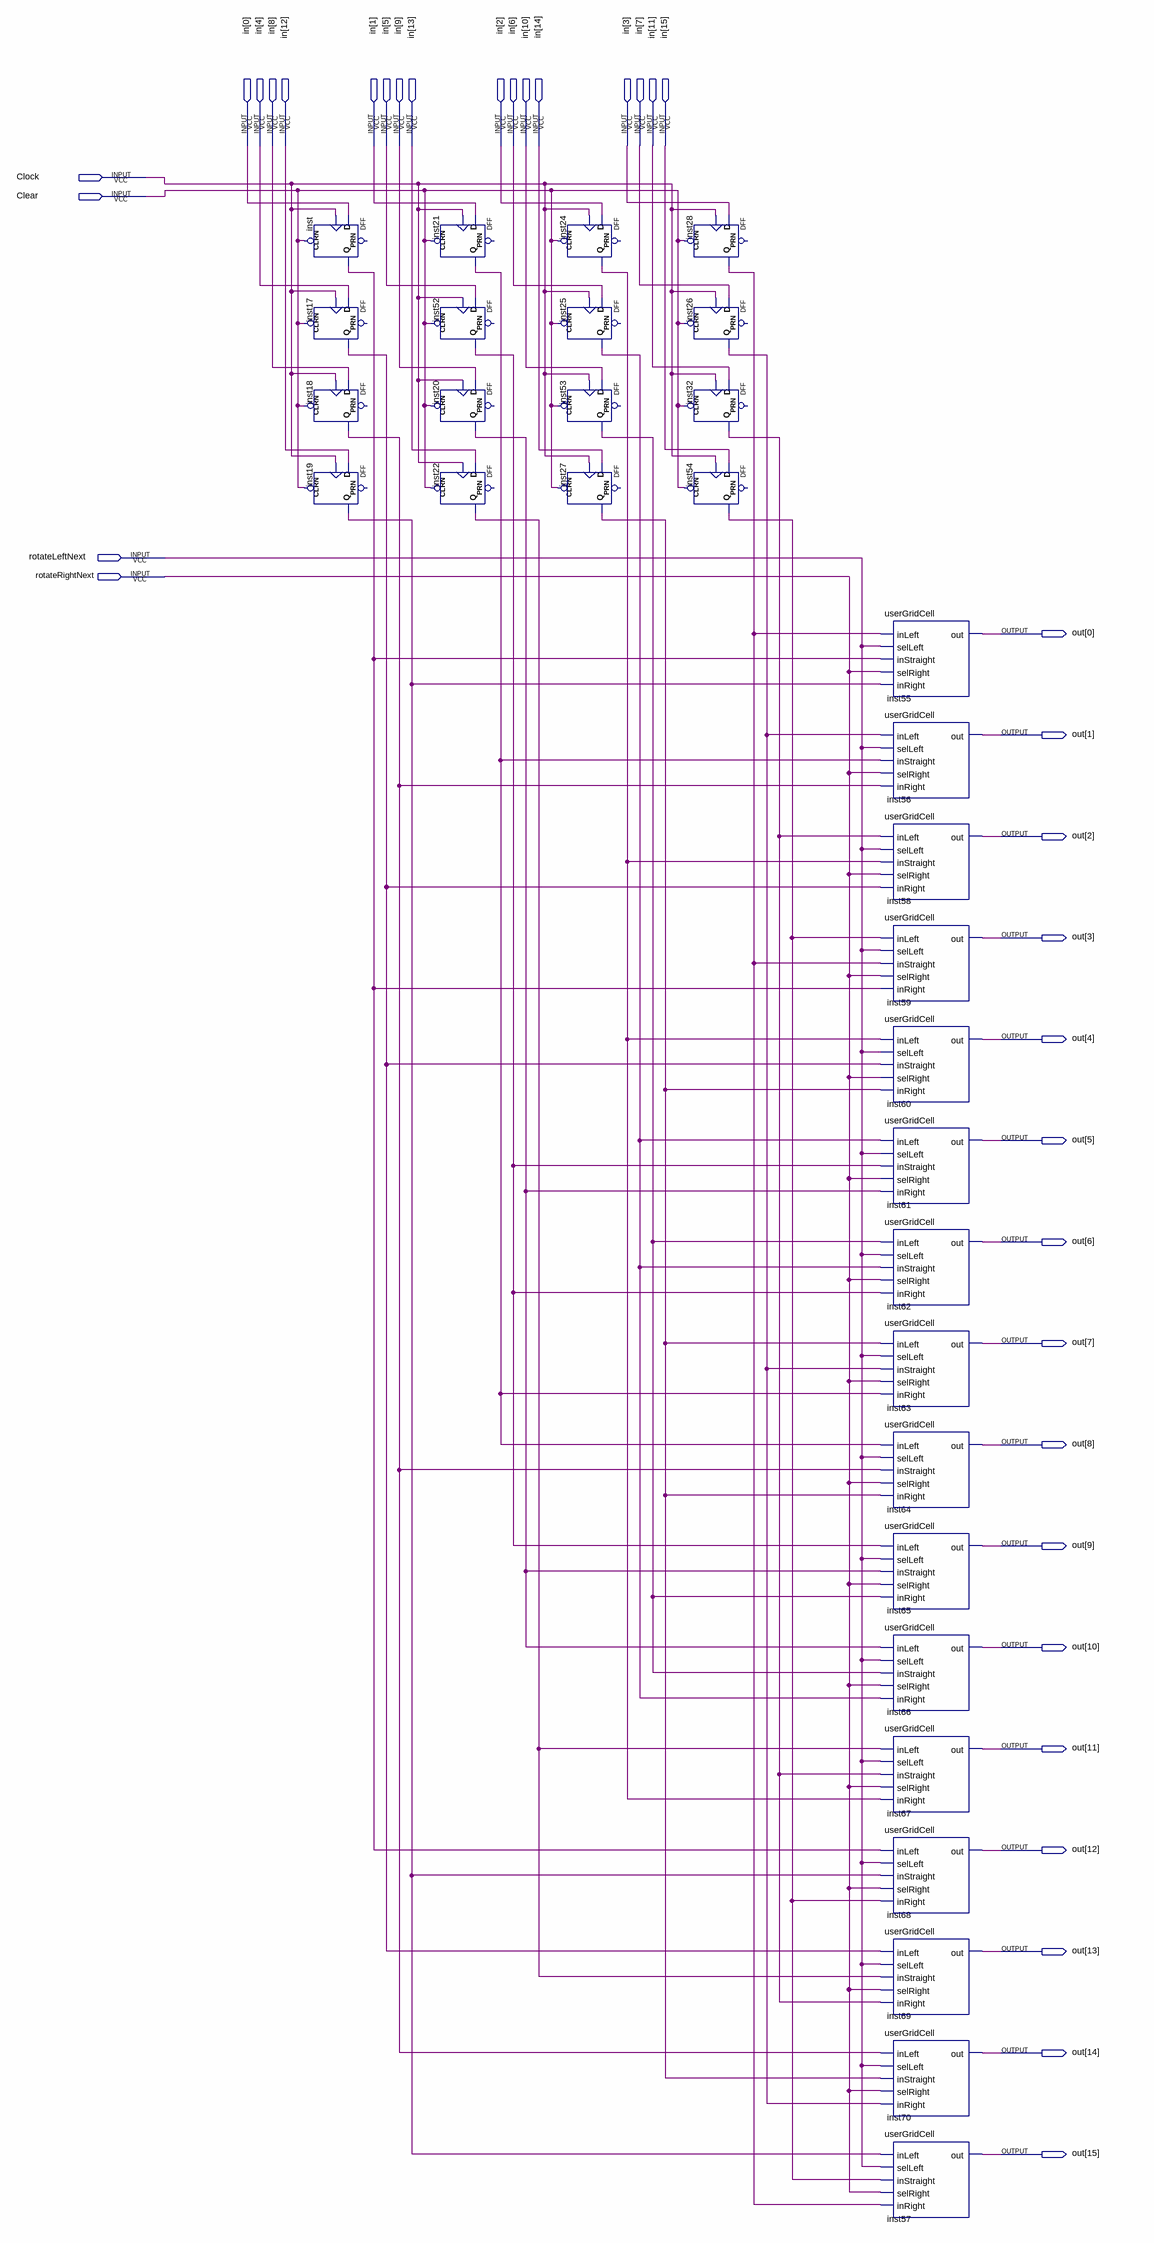
[diagram p0: schematic sheet]
// Quartus schematic userGrid.bdf as structural Verilog: 32 symbols, 36 pins
module userGrid (
  input  [15:0] in,
  input  Clock,
  input  Clear,
  input  rotateLeftNext,
  input  rotateRightNext,
  output [15:0] out
);

  wire inst17_q, inst18_q, inst19_q, inst20_q, inst21_q, inst22_q, inst24_q, inst25_q, inst26_q, inst27_q,
       inst28_q, inst32_q, inst52_q, inst53_q, inst54_q, inst_q;

  DFF inst (.CLRN(Clear), .CLK(Clock), .D(in[0]), .Q(inst_q));  // open: PRN
  DFF inst17 (.CLRN(Clear), .CLK(Clock), .D(in[4]), .Q(inst17_q));  // open: PRN
  DFF inst18 (.CLRN(Clear), .CLK(Clock), .D(in[8]), .Q(inst18_q));  // open: PRN
  DFF inst19 (.CLRN(Clear), .CLK(Clock), .D(in[12]), .Q(inst19_q));  // open: PRN
  DFF inst21 (.CLRN(Clear), .CLK(Clock), .D(in[1]), .Q(inst21_q));  // open: PRN
  DFF inst52 (.CLRN(Clear), .CLK(Clock), .D(in[5]), .Q(inst52_q));  // open: PRN
  DFF inst20 (.CLRN(Clear), .CLK(Clock), .D(in[9]), .Q(inst20_q));  // open: PRN
  DFF inst22 (.CLRN(Clear), .CLK(Clock), .D(in[13]), .Q(inst22_q));  // open: PRN
  DFF inst24 (.CLRN(Clear), .CLK(Clock), .D(in[2]), .Q(inst24_q));  // open: PRN
  DFF inst25 (.CLRN(Clear), .CLK(Clock), .D(in[6]), .Q(inst25_q));  // open: PRN
  DFF inst53 (.CLRN(Clear), .CLK(Clock), .D(in[10]), .Q(inst53_q));  // open: PRN
  DFF inst27 (.CLRN(Clear), .CLK(Clock), .D(in[14]), .Q(inst27_q));  // open: PRN
  DFF inst28 (.CLRN(Clear), .CLK(Clock), .D(in[3]), .Q(inst28_q));  // open: PRN
  DFF inst26 (.CLRN(Clear), .CLK(Clock), .D(in[7]), .Q(inst26_q));  // open: PRN
  DFF inst32 (.CLRN(Clear), .CLK(Clock), .D(in[11]), .Q(inst32_q));  // open: PRN
  DFF inst54 (.CLRN(Clear), .CLK(Clock), .D(in[15]), .Q(inst54_q));  // open: PRN
  userGridCell inst55 (
    .inLeft(inst28_q), .selLeft(rotateLeftNext), .inStraight(inst_q), .selRight(rotateRightNext),
    .inRight(inst19_q), .out(out[0]));
  userGridCell inst56 (
    .inLeft(inst26_q), .selLeft(rotateLeftNext), .inStraight(inst21_q), .selRight(rotateRightNext),
    .inRight(inst18_q), .out(out[1]));
  userGridCell inst58 (
    .inLeft(inst32_q), .selLeft(rotateLeftNext), .inStraight(inst24_q), .selRight(rotateRightNext),
    .inRight(inst17_q), .out(out[2]));
  userGridCell inst59 (
    .inLeft(inst54_q), .selLeft(rotateLeftNext), .inStraight(inst28_q), .selRight(rotateRightNext),
    .inRight(inst_q), .out(out[3]));
  userGridCell inst60 (
    .inLeft(inst24_q), .selLeft(rotateLeftNext), .inStraight(inst17_q), .selRight(rotateRightNext),
    .inRight(inst27_q), .out(out[4]));
  userGridCell inst61 (
    .inLeft(inst25_q), .selLeft(rotateLeftNext), .inStraight(inst52_q), .selRight(rotateRightNext),
    .inRight(inst20_q), .out(out[5]));
  userGridCell inst62 (
    .inLeft(inst53_q), .selLeft(rotateLeftNext), .inStraight(inst25_q), .selRight(rotateRightNext),
    .inRight(inst52_q), .out(out[6]));
  userGridCell inst63 (
    .inLeft(inst27_q), .selLeft(rotateLeftNext), .inStraight(inst26_q), .selRight(rotateRightNext),
    .inRight(inst21_q), .out(out[7]));
  userGridCell inst64 (
    .inLeft(inst21_q), .selLeft(rotateLeftNext), .inStraight(inst18_q), .selRight(rotateRightNext),
    .inRight(inst27_q), .out(out[8]));
  userGridCell inst65 (
    .inLeft(inst52_q), .selLeft(rotateLeftNext), .inStraight(inst20_q), .selRight(rotateRightNext),
    .inRight(inst53_q), .out(out[9]));
  userGridCell inst66 (
    .inLeft(inst20_q), .selLeft(rotateLeftNext), .inStraight(inst53_q), .selRight(rotateRightNext),
    .inRight(inst25_q), .out(out[10]));
  userGridCell inst67 (
    .inLeft(inst22_q), .selLeft(rotateLeftNext), .inStraight(inst32_q), .selRight(rotateRightNext),
    .inRight(inst24_q), .out(out[11]));
  userGridCell inst68 (
    .inLeft(inst_q), .selLeft(rotateLeftNext), .inStraight(inst19_q), .selRight(rotateRightNext),
    .inRight(inst54_q), .out(out[12]));
  userGridCell inst69 (
    .inLeft(inst17_q), .selLeft(rotateLeftNext), .inStraight(inst22_q), .selRight(rotateRightNext),
    .inRight(inst32_q), .out(out[13]));
  userGridCell inst70 (
    .inLeft(inst18_q), .selLeft(rotateLeftNext), .inStraight(inst27_q), .selRight(rotateRightNext),
    .inRight(inst26_q), .out(out[14]));
  userGridCell inst57 (
    .inLeft(inst19_q), .selLeft(rotateLeftNext), .inStraight(inst54_q), .selRight(rotateRightNext),
    .inRight(inst28_q), .out(out[15]));
endmodule
